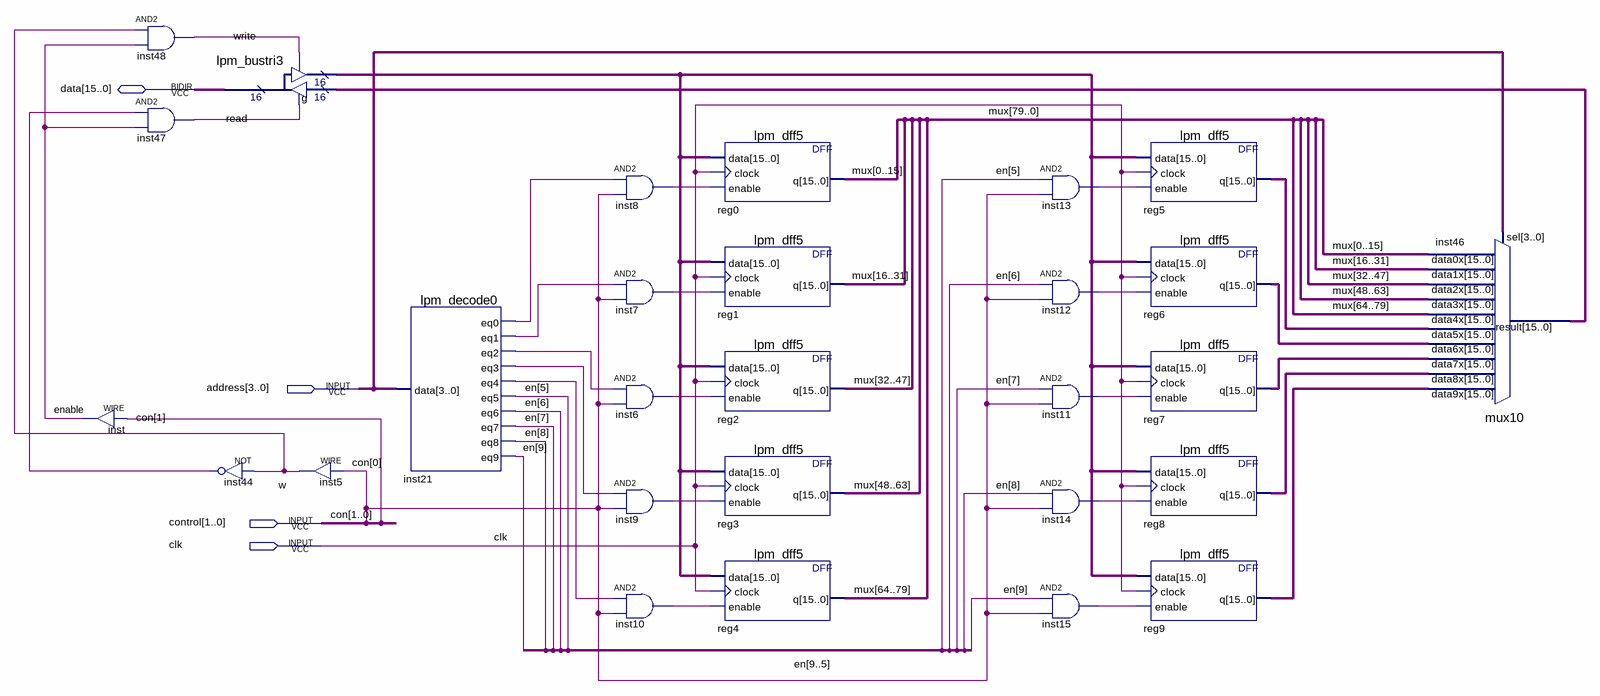
[diagram p0: schematic sheet]
// Quartus schematic register_block.bdf as structural Verilog: 28 symbols, 4 pins
module register_block (
  input  [3:0] address,
  input  [1:0] control,
  input  clk,
  inout  [15:0] data
);

  wire enable, inst6_out, inst7_out, inst8_out, inst9_out, inst10_out, inst11_out, inst12_out, inst13_out,
       inst14_out, inst15_out, inst21_eq0, inst21_eq1, inst21_eq2, inst21_eq3, inst21_eq4, inst44_out, read,
       w, write;
  wire [9:5] en;
  wire [15:0] g_result, inst46_result, reg5_q, reg6_q, reg7_q, reg8_q, reg9_q;
  wire [79:0] mux;

  assign enable = control[1];  // WIRE inst
  and inst48 (write, w, enable);
  and inst47 (read, inst44_out, enable);
  lpm_bustri3 g (.enabledt(read), .data(inst46_result), .enabletr(write), .result(g_result), .tridata(data));
  not inst44 (inst44_out, w);
  assign w = control[0];  // WIRE inst5
  lpm_decode0 inst21 (
    .data(address), .eq0(inst21_eq0), .eq1(inst21_eq1), .eq2(inst21_eq2), .eq3(inst21_eq3), .eq4(inst21_eq4),
    .eq5(en[5]), .eq6(en[6]), .eq7(en[7]), .eq8(en[8]), .eq9(en[9]));
  and inst8 (inst8_out, inst21_eq0, control[0]);
  and inst7 (inst7_out, inst21_eq1, control[0]);
  and inst6 (inst6_out, inst21_eq2, control[0]);
  and inst9 (inst9_out, inst21_eq3, control[0]);
  and inst10 (inst10_out, inst21_eq4, control[0]);
  lpm_dff5 reg0 (
    .data(g_result), .clock(clk), .enable(inst8_out),
    .q({mux[0], mux[1], mux[2], mux[3], mux[4], mux[5], mux[6], mux[7], mux[8], mux[9], mux[10], mux[11], mux[12], mux[13], mux[14], mux[15]}));
  lpm_dff5 reg1 (
    .data(g_result), .clock(clk), .enable(inst7_out),
    .q({mux[16], mux[17], mux[18], mux[19], mux[20], mux[21], mux[22], mux[23], mux[24], mux[25], mux[26], mux[27], mux[28], mux[29], mux[30], mux[31]}));
  lpm_dff5 reg2 (
    .data(g_result), .clock(clk), .enable(inst6_out),
    .q({mux[32], mux[33], mux[34], mux[35], mux[36], mux[37], mux[38], mux[39], mux[40], mux[41], mux[42], mux[43], mux[44], mux[45], mux[46], mux[47]}));
  lpm_dff5 reg3 (
    .data(g_result), .clock(clk), .enable(inst9_out),
    .q({mux[48], mux[49], mux[50], mux[51], mux[52], mux[53], mux[54], mux[55], mux[56], mux[57], mux[58], mux[59], mux[60], mux[61], mux[62], mux[63]}));
  lpm_dff5 reg4 (
    .data(g_result), .clock(clk), .enable(inst10_out),
    .q({mux[64], mux[65], mux[66], mux[67], mux[68], mux[69], mux[70], mux[71], mux[72], mux[73], mux[74], mux[75], mux[76], mux[77], mux[78], mux[79]}));
  and inst13 (inst13_out, en[5], control[0]);
  and inst12 (inst12_out, en[6], control[0]);
  and inst11 (inst11_out, en[7], control[0]);
  and inst14 (inst14_out, en[8], control[0]);
  and inst15 (inst15_out, en[9], control[0]);
  lpm_dff5 reg5 (.data(g_result), .clock(clk), .enable(inst13_out), .q(reg5_q));
  lpm_dff5 reg6 (.data(g_result), .clock(clk), .enable(inst12_out), .q(reg6_q));
  lpm_dff5 reg7 (.data(g_result), .clock(clk), .enable(inst11_out), .q(reg7_q));
  lpm_dff5 reg8 (.data(g_result), .clock(clk), .enable(inst14_out), .q(reg8_q));
  lpm_dff5 reg9 (.data(g_result), .clock(clk), .enable(inst15_out), .q(reg9_q));
  mux10 inst46 (
    .data9x(reg9_q), .data8x(reg8_q), .data7x(reg7_q), .data6x(reg6_q), .data5x(reg5_q),
    .data4x({mux[64], mux[65], mux[66], mux[67], mux[68], mux[69], mux[70], mux[71], mux[72], mux[73], mux[74], mux[75], mux[76], mux[77], mux[78], mux[79]}),
    .data3x({mux[48], mux[49], mux[50], mux[51], mux[52], mux[53], mux[54], mux[55], mux[56], mux[57], mux[58], mux[59], mux[60], mux[61], mux[62], mux[63]}),
    .data2x({mux[32], mux[33], mux[34], mux[35], mux[36], mux[37], mux[38], mux[39], mux[40], mux[41], mux[42], mux[43], mux[44], mux[45], mux[46], mux[47]}),
    .data1x({mux[16], mux[17], mux[18], mux[19], mux[20], mux[21], mux[22], mux[23], mux[24], mux[25], mux[26], mux[27], mux[28], mux[29], mux[30], mux[31]}),
    .data0x({mux[0], mux[1], mux[2], mux[3], mux[4], mux[5], mux[6], mux[7], mux[8], mux[9], mux[10], mux[11], mux[12], mux[13], mux[14], mux[15]}),
    .sel(address), .result(inst46_result));

  // Other names for the same wires on the sheet: con[1:0] = control
endmodule
